# EasyEDA Pro project ProPrj_transverter-front-end_2026-04-14.epro, schematic inter-board-barrier
Board Name: inter-board-barrier; Create Date: 2026-04-08; Page Name: P1; Project Name: transverter-front-end; Schematic Name: inter-board-barrier; Update Date: 2026-04-13; Company: EasyEDA.com; Page Size: A4; Version: V1.0
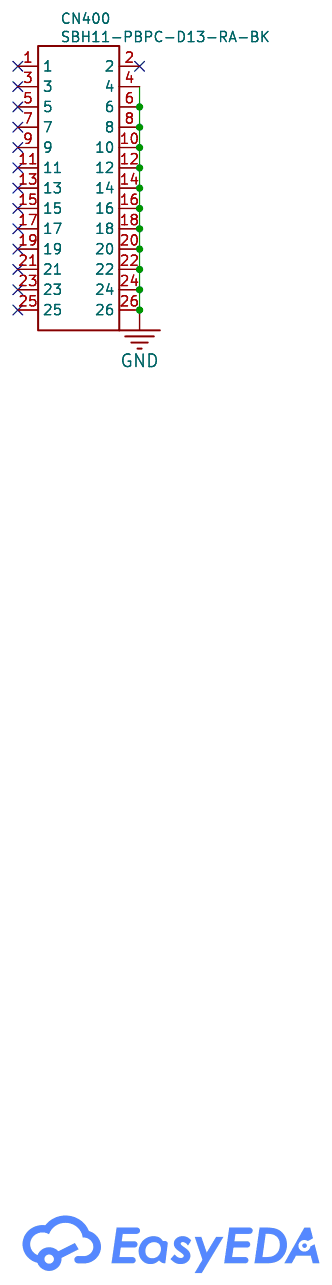
[diagram p0: schematic sheet]

## Parts
CN400  SBH11-PBPC-D13-RA-BK  [IDC-TH_26P-P2.54-H-M-R2-C13-W8.8]

## Library data of the parts
CN400 = SBH11-PBPC-D13-RA-BK: Supplier: LCSC; Supplier Part: C17260960; Manufacturer: Sullins; JLCPCB Part Class: Extended Part; Contributor: lcsc; spicePre: C

## Nets
GND: CN400.4 CN400.6 CN400.8 CN400.10 CN400.12 CN400.14 CN400.16 CN400.18 CN400.20 CN400.22 CN400.24 CN400.26

Not connected (* = marked no-connect by the designer): CN400 1* 2* 3* 5* 7* 9* 11* 13* 15* 17* 19* 21* 23* 25*
